# EAGLE design envelope_follower_1 (EAGLE 9.5.0)
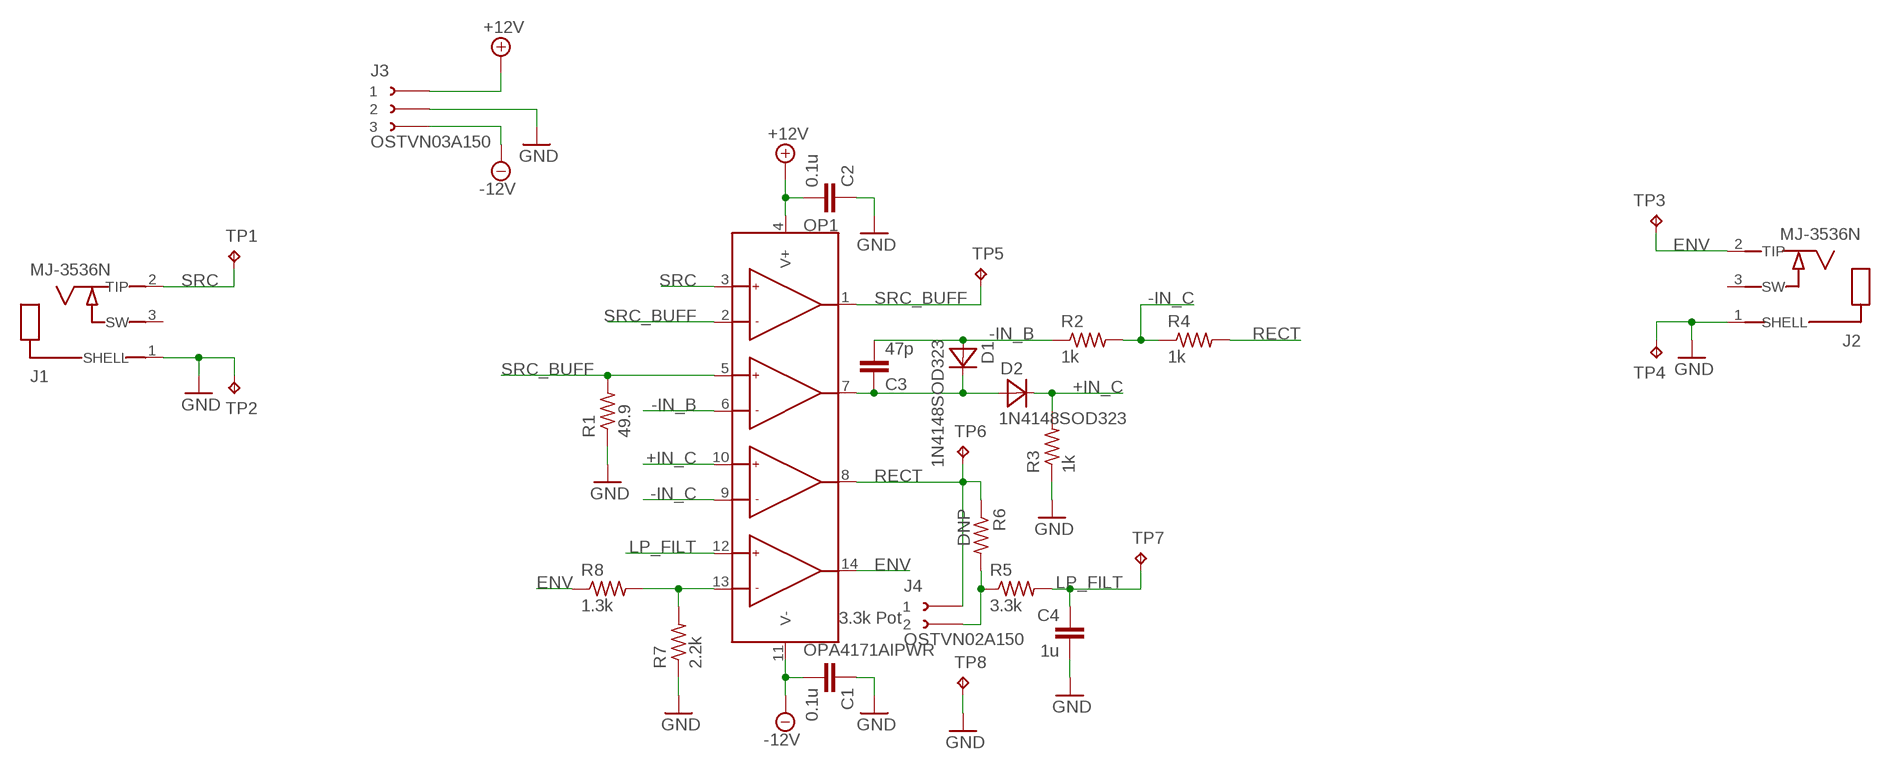
[diagram p0: schematic, sheet 1]

## Parts
C1  0.1u  CAP-CER-SMD0603  [C0603]
C2  0.1u  CAP-CER-SMD0603  [C0603]
C3  47p  CAP-CER-SMD0603  [C0603]
C4  1u  CAP-CER-SMD0603  [C0603]
D1  1N4148SOD323  [SOD323]
D2  1N4148SOD323  [SOD323]
J1  MJ-3536N  [MJ-3536N]
J2  MJ-3536N  [MJ-3536N]
J3  OSTVN03A150  [OSTVN03A150]
J4  OSTVN02A150  [OSTVN02A150]
OP1  OPA4171AIPWR  [SOP65P640X120-14]
R1  49.9  RES-SMD0603  [R0603]
R2  1k  RES-SMD0603  [R0603]
R3  1k  RES-SMD0603  [R0603]
R4  1k  RES-SMD0603  [R0603]
R5  3.3k  RES-SMD0603  [R0603]
R6  DNP  RES-SMD0603  [R0603]
R7  2.2k  RES-SMD0603  [R0603]
R8  1.3k  RES-SMD0603  [R0603]
TP1  TP_THM_1.6_S  [TP_THM_1.6_S]
TP2  TP_THM_1.6_S  [TP_THM_1.6_S]
TP3  TP_THM_1.6_S  [TP_THM_1.6_S]
TP4  TP_THM_1.6_S  [TP_THM_1.6_S]
TP5  TP_THM_1.6_S  [TP_THM_1.6_S]
TP6  TP_THM_1.6_S  [TP_THM_1.6_S]
TP7  TP_THM_1.6_S  [TP_THM_1.6_S]
TP8  TP_THM_1.6_S  [TP_THM_1.6_S]

## Nets
+12V: C2.2 J3.P$1 OP1.4(V+)
+IN_C: D2.C OP1.10(+IN_C) R3.2
-12V: C1.2 J3.P$3 OP1.11(V-)
-IN_B: C3.2 D1.A OP1.6(-IN_B) R2.1
-IN_C: OP1.9(-IN_C) R2.2 R4.1
ENV: J2.2(TIP) OP1.14(OUT_D) R8.1 TP3.P$1(TP)
GND: C1.1 C2.1 C4.2 J1.1(SHELL) J2.1(SHELL) J3.P$2 R1.1 R3.1 R7.1 TP2.P$1(TP) TP4.P$1(TP) TP8.P$1(TP)
LP_FILT: C4.1 OP1.12(+IN_D) R5.2 TP7.P$1(TP)
N$1: C3.1 D1.C D2.A OP1.7(OUT_B)
N$2: J4.P$2 R5.1 R6.2
N$3: OP1.13(-IN_D) R7.2 R8.2
RECT: J4.P$1 OP1.8(OUT_C) R4.2 R6.1 TP6.P$1(TP)
SRC: J1.2(TIP) OP1.3(+IN_A) TP1.P$1(TP)
SRC_BUFF: OP1.1(OUT_A) OP1.2(-IN_A) OP1.5(+IN_B) R1.2 TP5.P$1(TP)
Unconnected: J1.3(SW) J2.3(SW)

## Notes on the sheet
- 3.3k Pot

## Library data of the parts
C1-C4 = roomready:CAP-CER-SMD
D1 D2 = roomready:1N4148
J1 J2 = roomready:MJ-3536N
J3 = roomready:OSTVN03A150
J4 = roomready:OSTVN02A150
OP1 = roomready:OPA4171AIPWR
R1-R8 = roomready:RES-SMD
TP1-TP8 = roomready:TP_THM_1.6_S: For the following Keystone test points: Red: 5005, Black: 5006, White: 5007, Orange: 5008, Yellow: 5009, Brown: 5120, Green: 5121, Blue: 5122, Gray: 5123, Purple: 5124

## Board
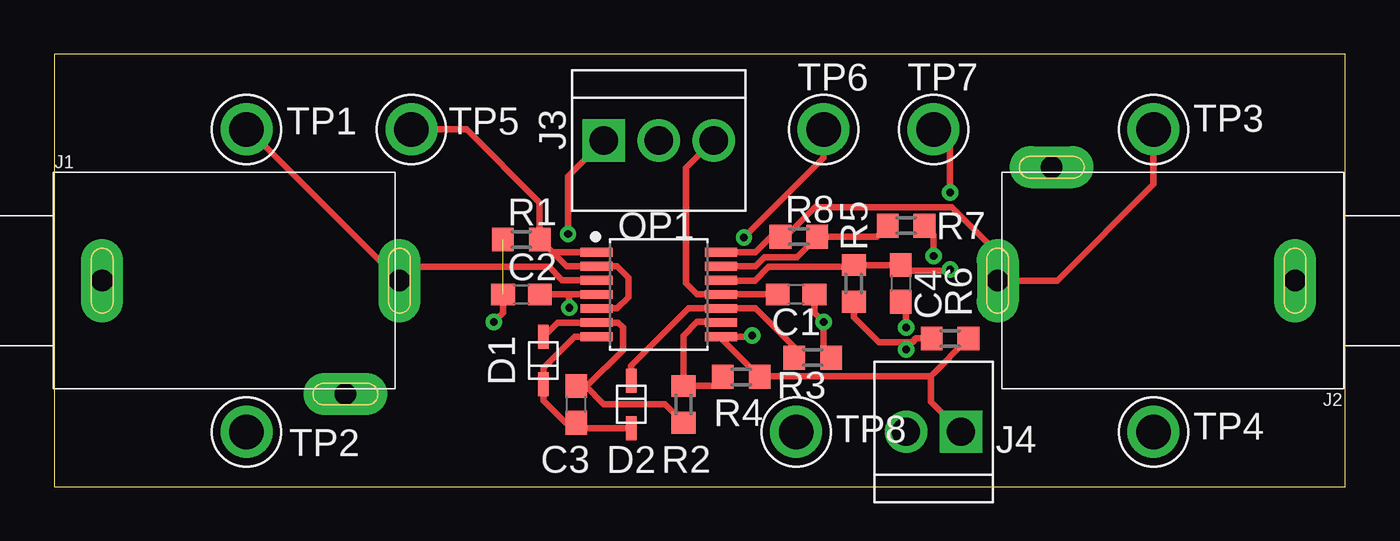
[diagram p1: board, top side]
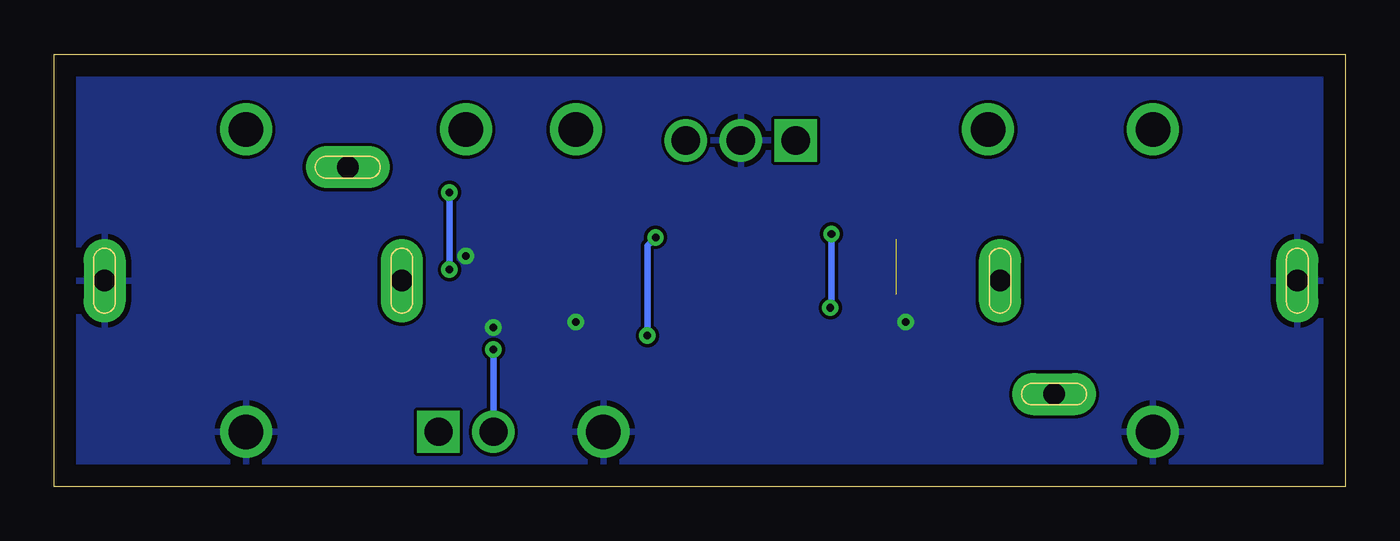
[diagram p2: board, bottom side, seen from below]

Size 59.67 x 19.99 mm. Coordinates in mm from the lower left corner, seen from the top.
Outline: 0,0 59.67,0 59.67,19.99 0,19.99 0,0
Copper layers (1*16): Top 0.035mm / dielectric 1.5mm / Bottom 0.035mm
Design rules "default": minimum track width 6mil, minimum drill 0.35mm, track to track 6mil, track to pad 6mil, pad to pad 6mil, via to via 6mil, smd to smd 6mil, copper to edge 40mil, drill to drill 6mil, minimum pad ring 10mil, minimum via ring 8mil, stop-mask expansion 4mil, vias tented up to drill 0mil, thermal gap 10mil

### Footprints (pad centres in the part's own frame; a part is rotated, then mirrored left to right if it is on the bottom)
C0603 = smd 1.1 x 1: 1 -0.85,0; 2 0.85,0
SOD323 = smd 1.112 x 0.472: A 1.1,0; C -1.1,0
MJ-3536N = drill 1 pad 1.93 long: 1 -11.24,0; 2 2.5,0; 3 0,-5.24
OSTVN03A150 = drill 1.3 square: P$1 -2.54,0 | drill 1.3: P$2 0,0; P$3 2.54,0
OSTVN02A150 = drill 1.3 square: P$1 -1.27,0 | drill 1.3: P$2 1.27,0
SOP65P640X120-14 = smd 1.469 x 0.407: 1 -2.871,1.95; 2 -2.871,1.3; 3 -2.871,0.65; 4 -2.871,0; 5 -2.871,-0.65; 6 -2.871,-1.3; 7 -2.871,-1.95; 8 2.871,-1.95; 9 2.871,-1.3; 10 2.871,-0.65; 11 2.871,0; 12 2.871,0.65; 13 2.871,1.3; 14 2.871,1.95
R0603 = smd 1 x 1.1: 1 -0.85,0; 2 0.85,0
TP_THM_1.6_S = drill 1.6: P$1 0,0

### Placement (x,y rotation side)
C1  34.29,8.89 180 top
C2  21.59,8.89 0 top
C3  24.13,3.81 90 top
C4  39.12,9.4 270 top
D1  22.61,5.84 90 top
D2  26.67,3.81 270 top
J1  13.46,9.53 0 top
J2  46.1,9.53 180 top
J3  27.94,16 0 top
J4  40.64,2.54 180 top
OP1  27.94,8.89 0 top
R1  21.59,11.43 0 top
R2  29.08,3.81 90 top
R3  35.05,5.97 180 top
R4  31.75,5.08 0 top
R5  36.96,9.4 90 top
R6  41.4,6.86 180 top
R7  39.37,12.06 180 top
R8  34.42,11.56 0 top
TP1  8.89,16.51 0 top
TP2  8.89,2.54 0 top
TP3  50.8,16.51 0 top
TP4  50.8,2.54 0 top
TP5  16.51,16.51 0 top
TP6  35.56,16.51 0 top
TP7  40.64,16.51 0 top
TP8  34.29,2.54 0 top

### Tracks (layer width: path | path; a pad name or v marks a point on that pad's centre or on a via)
+12V  (via drill 0.35)
  Top 0.305: OP1.4 23.75,8.89 | 23.75,8.89 C2.2 | J3.P$1 23.75,14.35 v23.75,11.68 | v23.8,8.27 23.8,8.84 23.75,8.89
  Bottom 0.305: v23.75,11.68 23.75,8.33 v23.8,8.27
+IN_C
  Top 0.305: D2.C 26.67,5.59 29.32,8.24 OP1.10 32.4,8.24 34.2,6.44 R3.2
-12V
  Top 0.305: C1.2 OP1.11 29.72,8.89 29.21,9.4 29.21,14.73 J3.P$3
-IN_B
  Top 0.305: D1.A 23.25,7.59 OP1.6 26.07,7.59 26.29,7.37 26.29,6.31 24.64,4.66 C3.2 24.55,4.66 25.4,3.81 28.23,3.81 R2.1
-IN_C
  Top 0.305: OP1.9 30.78,7.62 29.72,7.62 29.08,6.99 R2.2 30.48,4.66 R4.1
ENV
  Top 0.305: OP1.14 32.41,10.84 33.12,11.56 R8.1 33.79,11.56 35.15,12.92 41.48,12.92 43.6,10.79 J2.2 46.35,9.53 50.8,13.97 TP3.P$1
GND  (via drill 0.35)  (1 unrouted)
  Top 0.305: C2.1 20.74,8.04 v20.32,7.62 | C1.1 35.14,8.04 v35.56,7.62 35.56,6.31 R3.1 | C4.2 39.37,8.29 v39.37,7.37 | R7.1 40.64,11.64 v40.64,10.67
  pour Bottom: 0,20.32 59.69,20.32 59.69,0 0,0
LP_FILT  (via drill 0.35)
  Top 0.305: OP1.12 30.83,9.53 32.38,9.53 33.02,10.16 36.87,10.16 R5.2 C4.1 39.38,9.98 41.35,9.98 v41.4,10.03 | TP7.P$1 41.4,15.75 v41.4,13.6
  Bottom 0.305: v41.4,13.6 v41.4,10.03
N$1
  Top 0.305: OP1.7 24.04,6.94 22.61,5.5 D1.C 22.61,3.98 23.63,2.96 C3.1 24.38,2.71 D2.A
N$2  (via drill 0.35)
  Top 0.305: R5.1 36.96,7.83 38.11,6.68 39.37,6.68 | R6.2 39.83,6.86 39.65,6.68 39.37,6.68 | v39.37,6.35 39.37,6.68
  Bottom 0.305: J4.P$2 v39.37,6.35
N$3
  Top 0.305: OP1.13 32.4,10.19 32.83,10.62 34.33,10.62 R8.2 38.01,11.56 R7.2
RECT  (via drill 0.35)
  Top 0.305: v32.26,6.99 32.21,6.94 OP1.8 30.81,6.87 R4.2 32.63,5.11 40.51,5.11 | v31.88,11.52 35.56,15.21 TP6.P$1 | R6.1 40.51,5.11 | 40.51,5.11 40.51,3.94 J4.P$1
  Bottom 0.305: v32.26,6.99 32.26,11.14 v31.88,11.52
SRC
  Top 0.305: OP1.3 23.48,9.54 22.86,10.16 16.6,10.16 J1.2 8.98,16.51 TP1.P$1
SRC_BUFF
  Top 0.305: OP1.1 23.03,10.84 | 23.03,10.84 R1.2 22.44,13.12 19.05,16.51 TP5.P$1 | 23.03,10.84 23.68,10.19 OP1.2 26,10.19 26.54,9.65 26.54,8.76 26.02,8.24 OP1.5